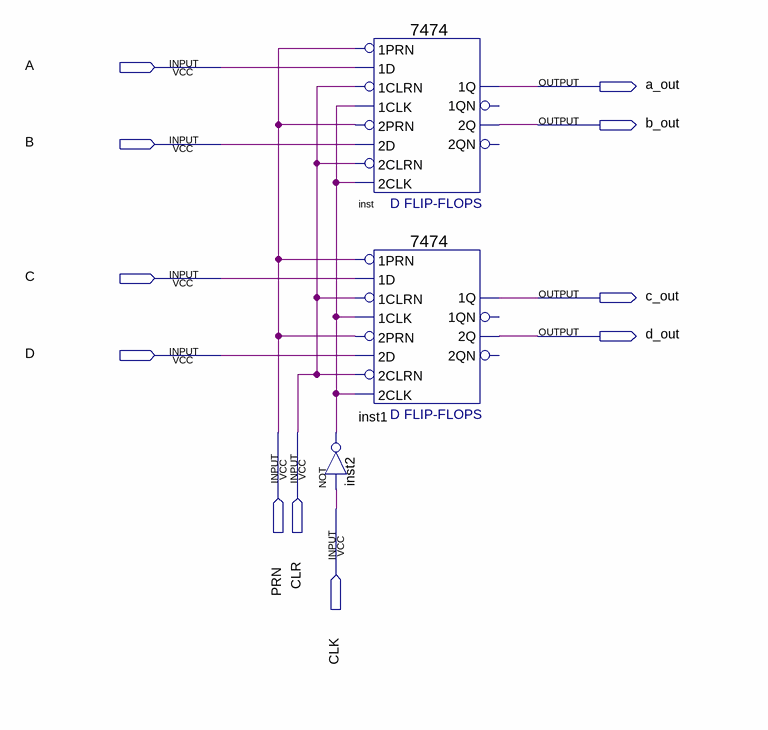
[diagram p0: schematic sheet]
// Quartus schematic Lab_8_Section_1.bdf as structural Verilog: 3 symbols, 11 pins
module Lab_8_Section_1 (
  input  A,
  input  B,
  input  C,
  input  D,
  input  PRN,
  input  CLR,
  input  CLK,
  output a_out,
  output b_out,
  output c_out,
  output d_out
);

  wire inst2_out;

  \7474  inst (
    .\2D (B), .\2PRN (PRN), .\1CLK (inst2_out), .\1D (A), .\1PRN (PRN), .\2CLK (inst2_out), .\2CLRN (CLR),
    .\1CLRN (CLR), .\2Q (b_out), .\1Q (a_out));  // open: 1QN, 2QN
  \7474  inst1 (
    .\2D (D), .\2PRN (PRN), .\1CLK (inst2_out), .\1D (C), .\1PRN (PRN), .\2CLK (inst2_out), .\2CLRN (CLR),
    .\1CLRN (CLR), .\2Q (d_out), .\1Q (c_out));  // open: 1QN, 2QN
  not inst2 (inst2_out, CLK);
endmodule
